# EAGLE design 0123-class-d-amp-max98365 (EAGLE 9.6.2)
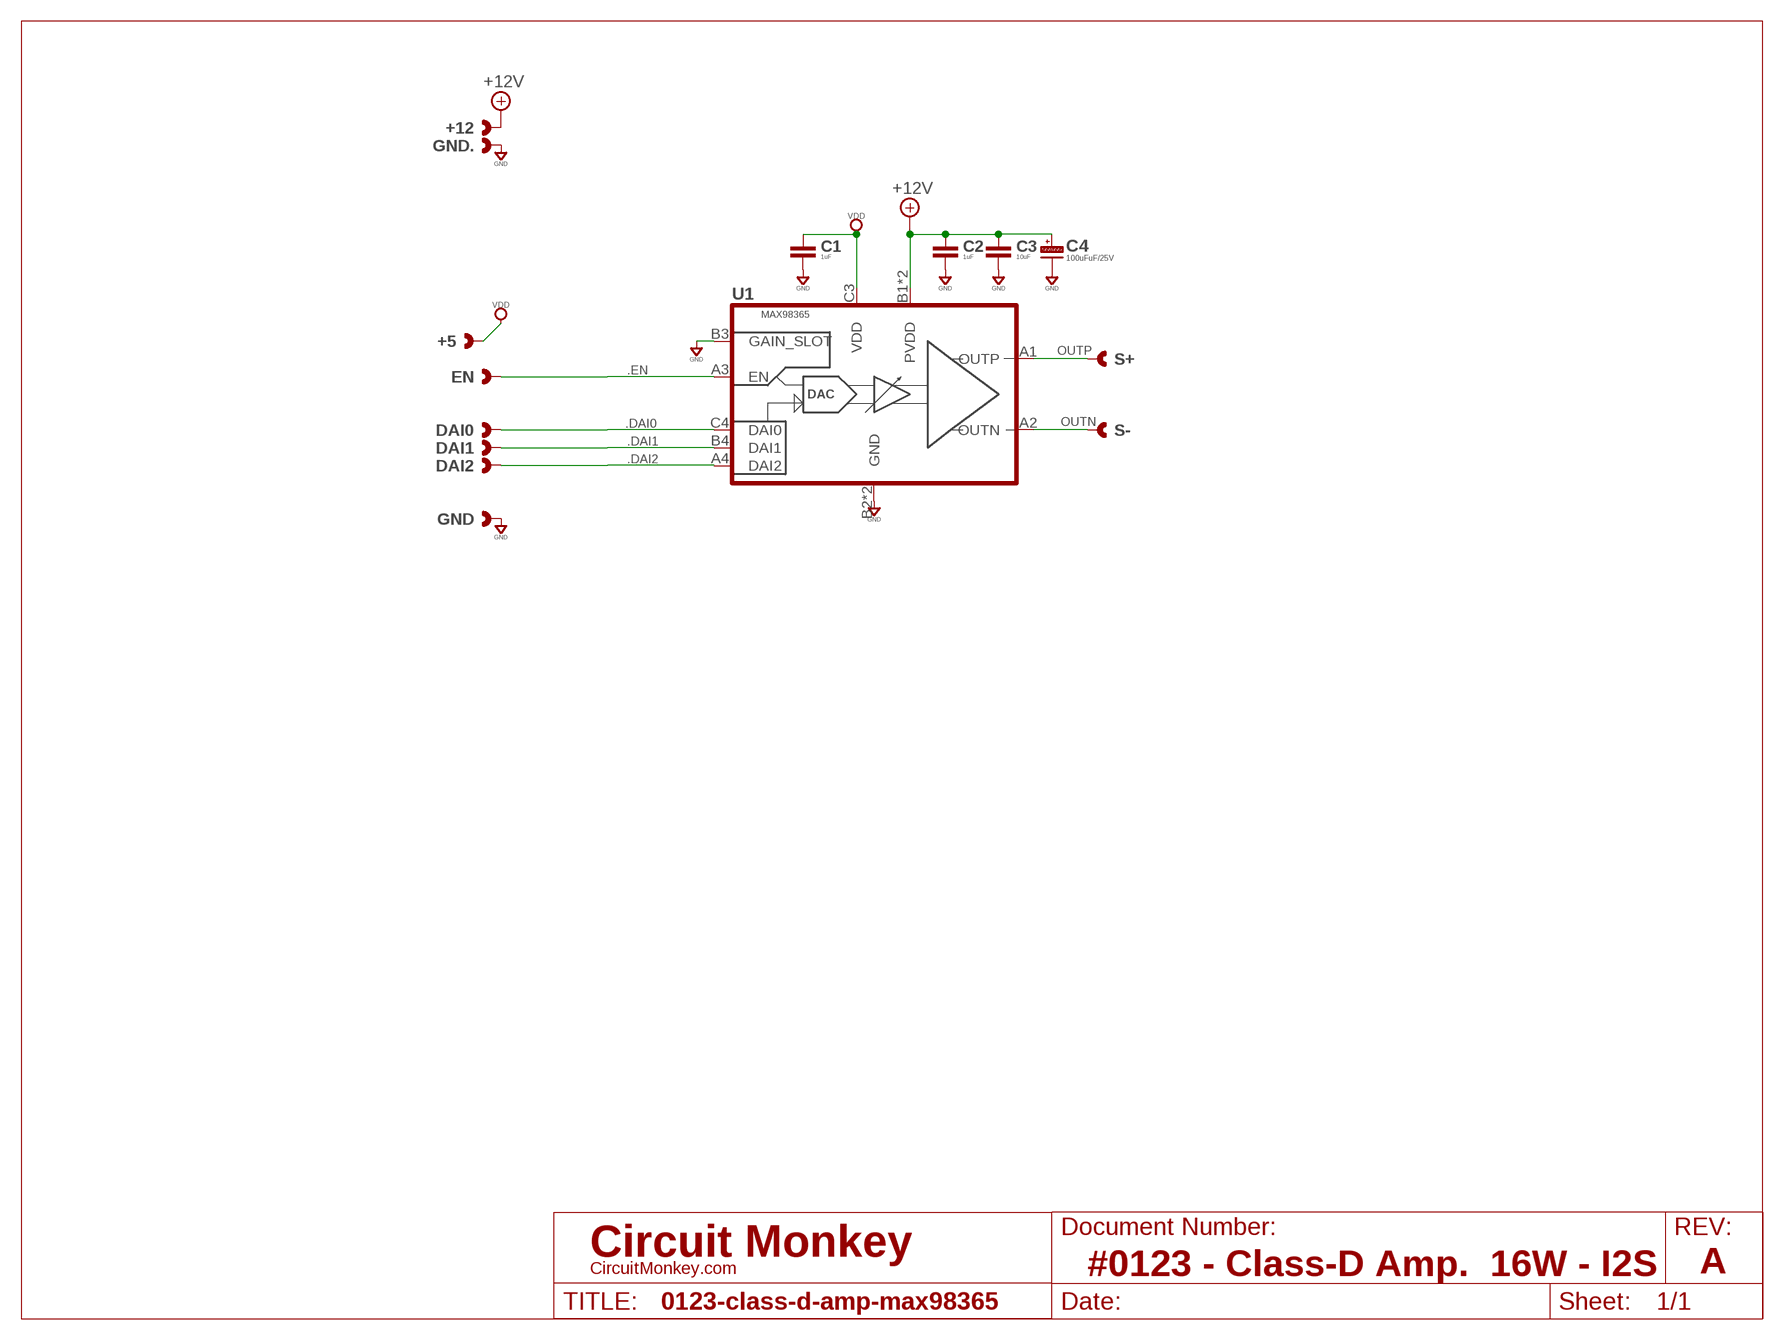
[diagram p0: schematic, sheet 1]
SHEET1 (LETTER_L-CIRCUITMONKEY): DOCUMENT_NUMBER: #0123 - Class-D Amp. 16W - I2S; REV: A

## Parts
+5  CAST-01X12.00MM  [CAST01-2.00MM]
+12  CAST-01X12.00MM  [CAST01-2.00MM]
C1  1uF  CAPACITOR0603  [0603-CAP]
C2  1uF  CAPACITOR0603  [0603-CAP]
C3  10uF  CAPACITOR0603  [0603-CAP]
C4  100uFuF/25V  CAPACITOR_POL-ALUM-SMT-6.3  [CAP_ALUM_SMT_6.3]
DAI0  CAST-01X12.00MM  [CAST01-2.00MM]
DAI1  CAST-01X12.00MM  [CAST01-2.00MM]
DAI2  CAST-01X12.00MM  [CAST01-2.00MM]
EN  CAST-01X12.00MM  [CAST01-2.00MM]
GND  CAST-01X12.00MM  [CAST01-2.00MM]
GND.  CAST-01X12.00MM  [CAST01-2.00MM]
S+  CAST-01X12.00MM  [CAST01-2.00MM]
S-  CAST-01X12.00MM  [CAST01-2.00MM]
U1  MAX98365  [12WLP]

## Nets
+12V: +12.1 +12.P$1 +12.P$2 C2.1 C3.1 C4.+(P) U1.B1(PVDD) U1.C1(PVDD)
.DAI0: DAI0.1 DAI0.P$1 DAI0.P$2 U1.C4(DAI0)
.DAI1: DAI1.1 DAI1.P$1 DAI1.P$2 U1.B4(DAI1)
.DAI2: DAI2.1 DAI2.P$1 DAI2.P$2 U1.A4(DAI2)
.EN: EN.1 EN.P$1 EN.P$2 U1.A3(EN)
GND: C1.2 C2.2 C3.2 C4.-(N) GND.1 GND..1 GND..P$1 GND..P$2 GND.P$1 GND.P$2 U1.B2(GND) U1.B3(GAIN_SLOT) U1.C2(GND)
OUTN: S-.1 S-.P$1 S-.P$2 U1.A2(OUTN)
OUTP: S+.1 S+.P$1 S+.P$2 U1.A1(OUTP)
VDD: +5.1 +5.P$1 +5.P$2 C1.1 U1.C3(VDD)

## Library data of the parts
+5 +12 DAI0 DAI1 DAI2 EN GND GND. S+ S- = con-headers:CAST-01X1: Castelated Edge Hole Pad
C1-C3 = rlc:CAPACITOR: Capacitor; COST01: 0.12; COST10: 0.09; COST100: 0.05
C4 = rlc:CAPACITOR_POL: Polarized Capacitor; VALUE: XXuF/xxV - 6.3mm
U1 = co-maxim:MAX98365: MAX98365 Class-D Audio Amplifier, 18W; COST01: 1.75; COST10: 1.60; COST100: 1.25; MFR: Maxim; MPN: MAX98365A/C

## Board
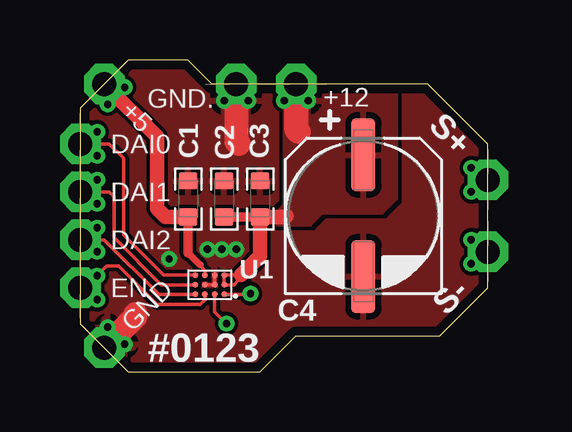
[diagram p1: board, top side]
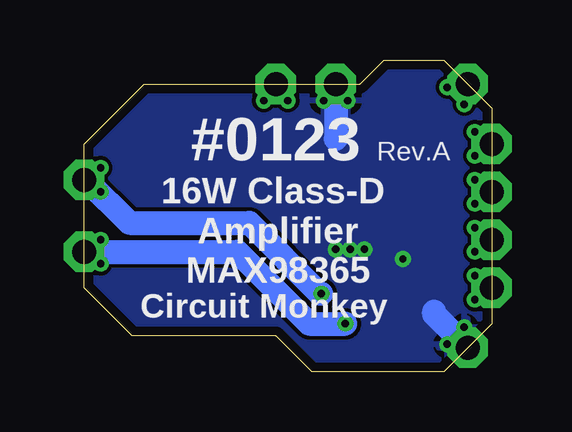
[diagram p2: board, bottom side, seen from below]

Size 17 x 13 mm. Coordinates in mm from the lower left corner, seen from the top.
Outline: 2,0 7.5,0 9,1.5 15,1.5 17,3.5 17,9.5 14.5,12 5.5,12 4.5,13 2,13 0,11 0,2 2,0
Copper layers (1*16): Top 0.0356mm / dielectric 1.5011mm / Bottom 0.0356mm
Design rules "OSH-CircuitMonkey": minimum track width 6mil, minimum drill 12mil, track to track 6mil, track to pad 6mil, pad to pad 6mil, via to via 6mil, smd to smd 6mil, copper to edge 15mil, drill to drill 6mil, minimum pad ring 7mil, minimum via ring 7mil, stop-mask expansion 3mil, vias tented up to drill 13mil, thermal gap 10mil

### Footprints (pad centres in the part's own frame; a part is rotated, then mirrored left to right if it is on the bottom)
CAST01-2.00MM = drill 1 pad 1.7 octagon: 1 0,0 | drill 0.305: P$1 -0.7,0.5; P$2 -0.7,-0.5
0603-CAP = smd 0.711 x 0.762: 1 -0.752,0; 2 0.752,0
CAP_ALUM_SMT_6.3 = smd 3.048 x 1.016: + 2.54,0; - -2.54,0
12WLP = smd 0.24 x 0.24: A1 -0.6,0.4; A2 -0.2,0.4; A3 0.2,0.4; A4 0.6,0.4; B1 -0.6,0; B2 -0.2,0; B3 0.2,0; B4 0.6,0; C1 -0.6,-0.4; C2 -0.2,-0.4; C3 0.2,-0.4; C4 0.6,-0.4

### Placement (x,y rotation side)
+5  1,12 135 top
+12  9,12 90 top
C1  4.5,7.2 90 top
C2  6,7.2 90 top
C3  7.5,7.2 90 top
C4  11.8,6.5 90 top
DAI0  0,9.5 180 top
DAI1  0,7.5 180 top
DAI2  0,5.5 180 top
EN  0,3.5 180 top
GND  1,1 225 top
GND.  6.5,12 90 top
S+  17,8 0 top
S-  17,5 0 top
U1  5.4,3.62 180 top

### Tracks (layer width: path | path; a pad name or v marks a point on that pad's centre or on a via)
+12V
  Top 0.152: 6.7,4.03 6.01,4.03 U1.C1 U1.B1 6.4,3.62 6.6,3.82 | +12.P$2 9.5,11.5 +12.1 9,11.8 +12.P$1
  Top 0.4: C3.1 C2.1
  Top 0.6: 8.6,6.5 8.55,6.45 C3.1 7.5,4.83 6.7,4.03
  Top 1: +12.1 9,10.1 9.1,10
  pour Top: 8.5,12 13.2,12 13.2,7.2 12.6,6.6 10.1,6.6 9.6,6.1 8.2,6.1 8.2,6.7 8.5,7
.DAI0
  Top 0.152: DAI0.1 0.5,10 DAI0.P$2 | DAI0.1 0.5,9 DAI0.P$1 | DAI0.1 1.2,9.5 1.8,8.9 1.8,5.7 3.48,4.02 U1.C4
.DAI1
  Top 0.152: DAI1.1 1.2,7.5 1.4,7.3 1.4,5.6 3.38,3.62 U1.B4 | DAI1.1 0.5,8 DAI1.P$2 | DAI1.1 0.5,7 DAI1.P$1
.DAI2
  Top 0.152: DAI2.1 1,5.5 3.28,3.22 U1.A4 | DAI2.1 0.5,6 DAI2.P$2 | DAI2.1 0.5,5 DAI2.P$1
.EN
  Top 0.152: U1.A3 5.2,3 5,2.8 3.2,2.8 1.6,4.4 1.1,4.4 0.2,3.5 EN.1 | EN.1 0.5,4 EN.P$2 | EN.1 0.5,3 EN.P$1
GND  (via drill 0.3)
  Top 0.152: 1.14,1.14 GND.P$2 | GND.1 1.14,1.14 | 1.14,1.14 GND.P$1 | U1.B3 U1.B2 U1.C2 | 6.5,11.8 GND..P$2 | GND..1 6.5,11.8 | 6.5,11.8 GND..P$1
  Top 1: GND.1 2.3,2.3 2.3,2.4 | GND..1 6.5,9.6 6.6,9.5
  Bottom 1: GND..1 6.5,9.7 | GND.1 2.4,2.4 2.4,2.5
  other vias: 5.3,5.1 5.9,5.1 6.5,5.1 3.7,4.7
  pour Top (rank 5): 2,0 0,2 0,11 2,13 4.5,13 5.5,12 14.5,12 17,9.5 17,3.5 15,1.5 9,1.5 7.5,0
  pour Bottom (rank 5): 0,2 0,11 2,13 4.5,13 5.5,12 14.5,12 17,9.5 17,3.5 15,1.5 9,1.5 7.5,0 2,0
OUTN  (via drill 0.3)
  Top 0.152: v6.1,2 5.6,2.5 U1.A2
  Bottom 0.152: S-.P$1 16.8,5 S-.1 16.5,4.5 S-.P$2
  Bottom 1: S-.1 10.6,5 7.6,2 v6.1,2
OUTP  (via drill 0.3)
  Top 0.152: v7.1,3.25 7.08,3.23 U1.A1
  Bottom 0.152: S+.P$1 16.8,8 S+.1 16.5,7.5 S+.P$2
  Bottom 1: S+.1 16.9,8 15.1,6.2 10.1,6.2 7.15,3.25 v7.1,3.25
VDD
  Top 0.152: 5,4.45 5,4.42 5.2,4.22 U1.C3 | +5.P$2 1.71,12 +5.1 1.14,11.86 +5.P$1
  Top 0.3: 5,4.45 4.5,4.95
  Top 0.4: 4.5,4.95 C1.1
  Top 0.6: +5.1 3.2,9.8 3.2,6.8 3.55,6.45 C1.1

### Text on the board
tPlace: #0123
bPlace: #0123 | Rev.A | 16W Class-D / Amplifier / MAX98365 | Circuit Monkey